# EAGLE design SmartRockMS5803 (EAGLE 9.3.1)
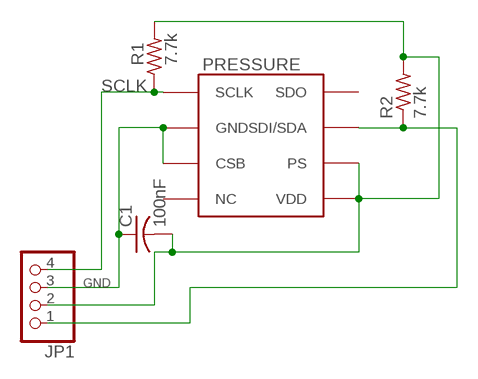
[diagram p0: schematic, sheet 1]

## Parts
C1  100nF  C-USC0805  [C0805]
JP1  PINHD-1X4  [1X04]
PRESSURE  MS5803-01BA  [SMD]
R1  7.7k  R-US_R0805  [R0805]
R2  7.7k  R-US_R0805  [R0805]

## Nets
GND: C1.1 JP1.3 PRESSURE.CSB PRESSURE.GND
N$3: C1.2 JP1.2 PRESSURE.PS PRESSURE.VDD R1.2 R2.2
N$4: JP1.1 PRESSURE.SDI/SDA R2.1
SCLK: JP1.4 PRESSURE.SCLK R1.1
Unconnected: PRESSURE.NC PRESSURE.SDO

## Library data of the parts
C1 = rcl:C-US: CAPACITOR, American symbol; SPICEPREFIX: C
JP1 = pinhead:PINHD-1X4: PIN HEADER
PRESSURE = MS5803-01BA:MS5803-01BA
R1 R2 = resistor:R-US_: RESISTOR, American symbol

## Board
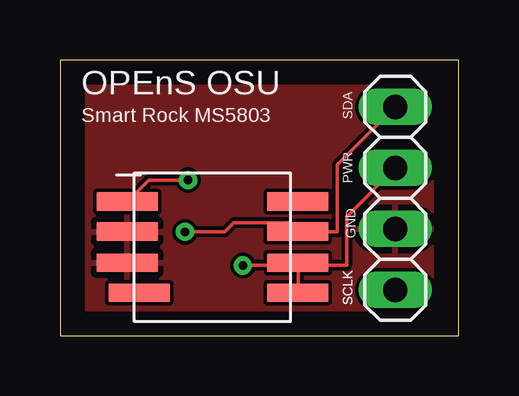
[diagram p1: board, top side]
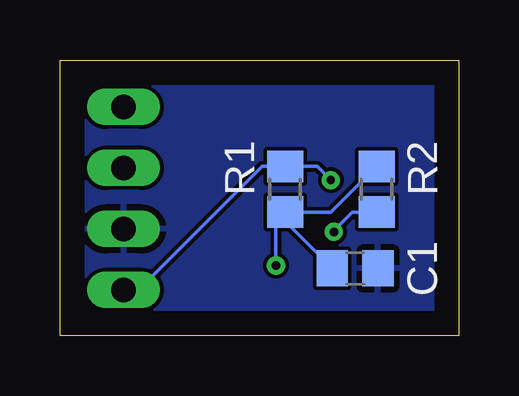
[diagram p2: board, bottom side, seen from below]

Size 16.62 x 11.48 mm. Coordinates in mm from the lower left corner, seen from the top.
Outline: 0,0 16.62,0 16.62,11.48 0,11.48 0,0
Copper layers (1*16): Top 0.035mm / dielectric 1.5mm / Bottom 0.035mm
Design rules "default": minimum track width 6mil, minimum drill 0.35mm, track to track 6mil, track to pad 6mil, pad to pad 6mil, via to via 6mil, smd to smd 6mil, copper to edge 40mil, drill to drill 6mil, minimum pad ring 10mil, minimum via ring 8mil, stop-mask expansion 4mil, vias tented up to drill 0mil, thermal gap 10mil

### Footprints (pad centres in the part's own frame; a part is rotated, then mirrored left to right if it is on the bottom)
C0805 = smd 1.3 x 1.5: 1 -0.95,0; 2 0.95,0
1X04 = drill 1.016 long: 1 -3.81,0; 2 -1.27,0; 3 1.27,0; 4 3.81,0
SMD = smd 2.54 x 0.762: CSB 3.556,0.65; GND 3.556,-0.65; NC 3.048,1.9; PS -3.556,0.65; SCLK 3.556,-1.9; SDI/SDA -3.556,-0.65; SDO -3.556,-1.9; VDD -3.556,1.9
R0805 = smd 1.3 x 1.5: 1 -0.95,0; 2 0.95,0

### Placement (x,y rotation side)
C1  4.32,2.79 180 bottom
JP1  13.97,5.71 270 top
PRESSURE  6.35,3.68 180 top
R1  7.24,6.1 270 bottom
R2  3.43,6.1 90 bottom

### Tracks (layer width: path | path; a pad name or v marks a point on that pad's centre or on a via)
GND
  pour Top: 0,0 0,11.43 16.64,11.43 16.64,0
  pour Bottom: 0,0 0,11.43 16.64,11.43 16.64,0
N$3  (via drill 0.35)
  Top 0.152: 9.92,3.05 PRESSURE.PS 9.79,2.92 v7.62,2.92 | PRESSURE.VDD 9.92,1.8 9.92,3.05 | JP1.2 11.94,4.95 11.94,2.92 10.05,2.92 9.92,3.05
  Bottom 0.152: R1.2 5.33,5.15 R2.2 4,7.62 | R1.2 7.62,4.76 v7.62,2.92 | C1.2 7.24,4.76 R1.2
N$4  (via drill 0.35)
  Top 0.152: v5.21,4.32 6.86,4.32 7.25,4.71 9.53,4.71 PRESSURE.SDI/SDA 9.92,4.32 11.56,4.32 11.56,7.11 JP1.1
  Bottom 0.152: v5.21,4.32 5.24,4.35 4.45,5.15 R2.1
SCLK  (via drill 0.35)
  Top 0.152: v5.33,6.48 3.69,6.48 PRESSURE.SCLK
  Bottom 0.152: v5.33,6.48 5.9,7.05 R1.1 8.19,7.05 13.34,1.91 JP1.4

### Text on the board
tPlace: OPEnS OSU | Smart Rock MS5803
tNames: SDA | PWR | GND | SCLK | SCLK